# Altium schematic sheet SIM-connector.schdoc
size 49 x 42 mm
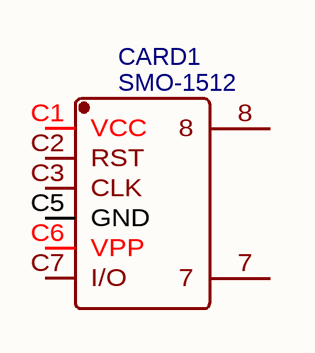
[diagram p0: SIM-connector.schdoc]

## Parts
CARD1  SMO-1512  [SIM-SMD_SMO-1512]

## Nets

Not connected (* = marked no-connect by the designer): CARD1 7 8 C1(VCC) C2(RST) C3(CLK) C5(GND) C6(VPP) C7(I/O)

## Library data of the parts
CARD1 = SMO-1512: BOM_Manufacturer: SOFNG; Contributor: LCSC; BOM_Supplier: LCSC; BOM_Manufacturer Part: SMO-1512; BOM_Supplier Part: C125621; spicePre: C; spiceSymbolName: SMO-1512